# Altium project Motor Controller.PrjPcb
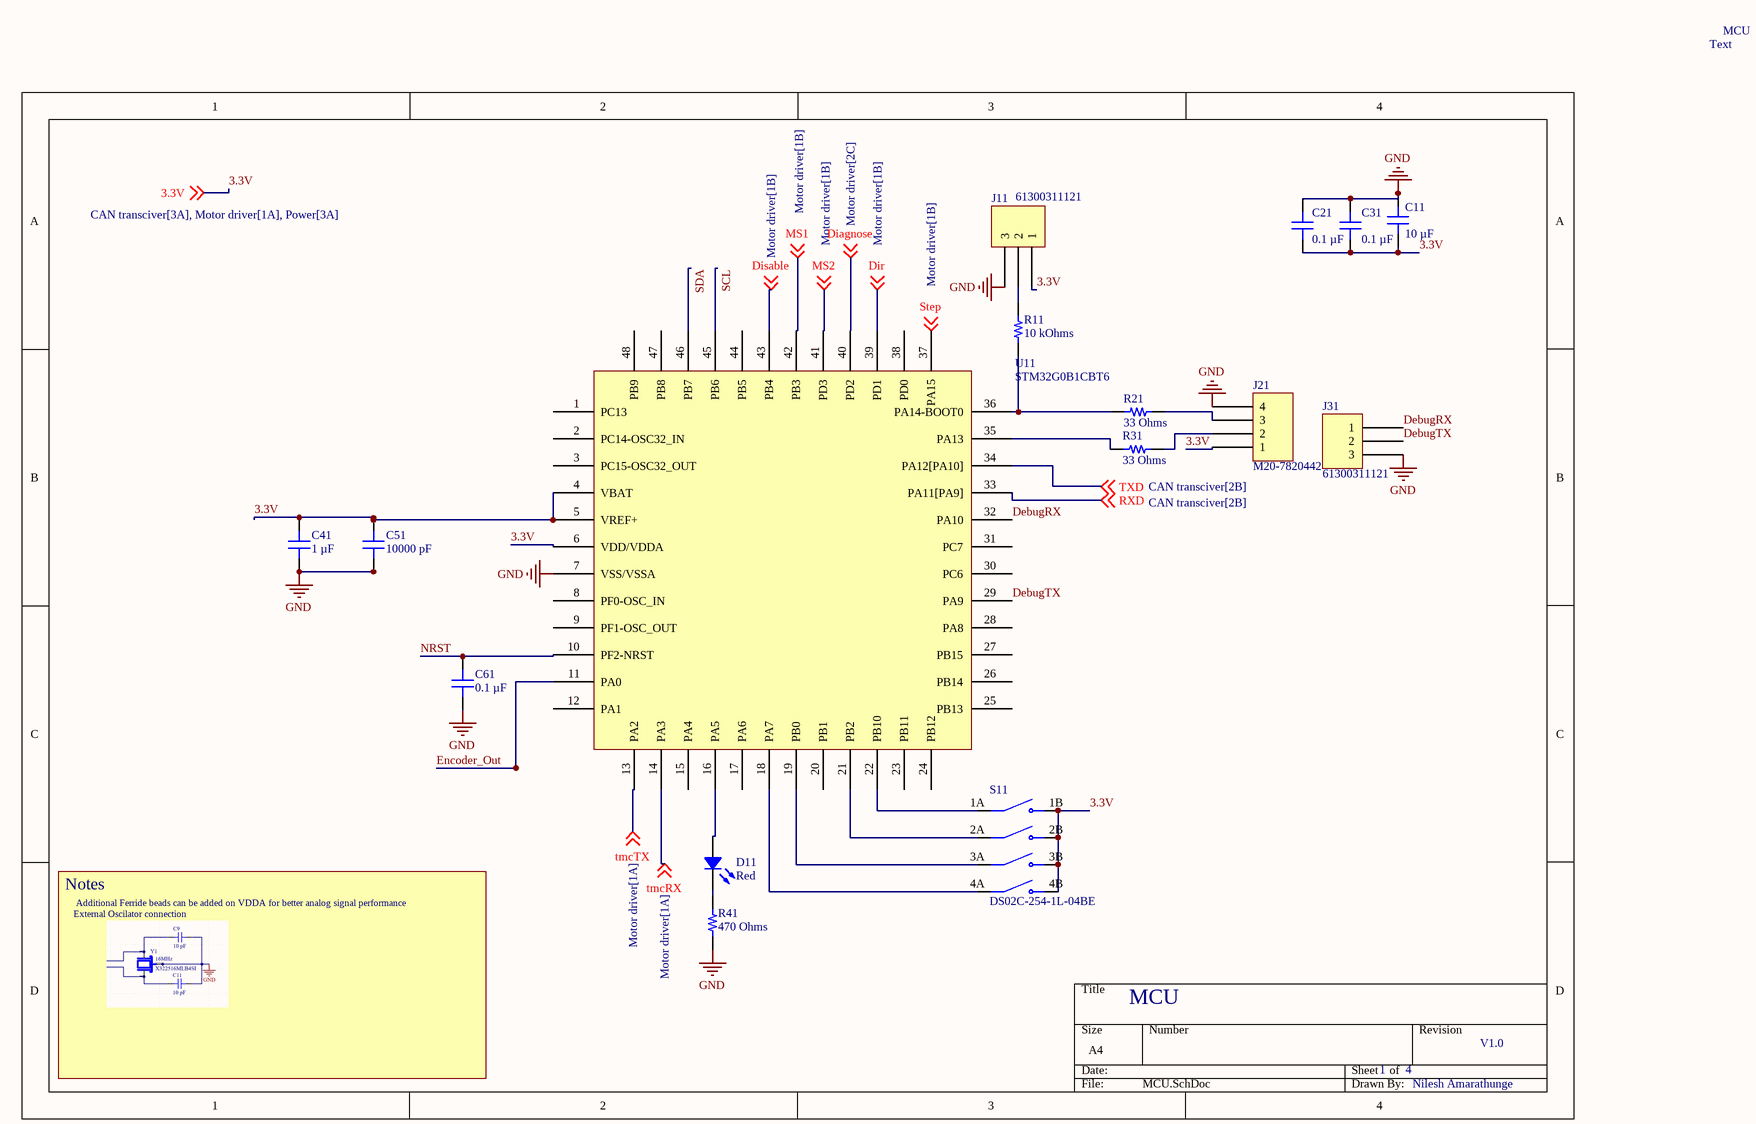
[diagram p0: MCU.SchDoc]
4 sheets, 50 parts. Net scope: global (net labels, ports and power ports of the same name join across sheets).
Board file: Motor Controller.PcbDoc
Sheets:
  MCU.SchDoc
  Power.SchDoc
  Motor driver.SchDoc
  CAN transciver.SchDoc

## Sheet MCU.SchDoc: MCU
size A4; DrawnBy: Nilesh Amarathunge; Revision: V1.0; SheetNumber: 1; SheetTotal: 4

### Parts
C11  10 µF  [CAP 0805_2012]
C21  0.1 µF  [CAP 0805_2012]
C31  0.1 µF  [CAP 0805_2012]
C41  1 µF  [CAP 0805_2012]
C51  10000 pF  [CAP 0805_2012]
C61  0.1 µF  [CAP 0805_2012]
D11  Red  [LED 0805_2012 RED]
J11  61300311121  [WURTH WE-PHD 61300311121]
J21  M20-7820442  [HARWIN M20-7820445]
J31  61300311121  [WURTH WE-PHD 61300311121]
R11  10 kOhms  [YAGEO RES 0805_2012]
R21  33 Ohms  [RES 0805_2012]
R31  33 Ohms  [RES 0805_2012]
R41  470 Ohms  [RES 0805_2012]
S11  DS02C-254-1L-04BE  [SW_DS02C-254-1L-04BE]
U11  STM32G0B1CBT6  [QFP50P900X900X160-48N]

### Nets
GND: C11.2 C21.2 C31.2 C41.2 C51.2 C61.2 J11.3 J21.4 J31.3 R41.1 U11.7(VSS/VSSA)
3.3V: C11.1 C21.1 C31.1 C41.1 C51.1 J11.1 J21.1 S11.1B(NO1) S11.2B(NO2) S11.3B(NO3) S11.4B(NO4) U11.4(VBAT) U11.5(VREF+) U11.6(VDD/VDDA) ; off-sheet 3.3V
DebugRX: J31.1 U11.32(PA10)
DebugTX: J31.2 U11.29(PA9)
Diagnose: U11.40(PD2) ; off-sheet Diagnose
Dir: U11.39(PD1) ; off-sheet Dir
Disable: U11.43(PB4) ; off-sheet Disable
Encoder_Out: U11.11(PA0)
MS1: U11.42(PB3) ; off-sheet MS1
MS2: U11.41(PD3) ; off-sheet MS2
NRST: C61.1 U11.10(PF2-NRST)
RXD: U11.33(PA11[PA9]) ; off-sheet RXD
SCL: U11.45(PB6)
SDA: U11.46(PB7)
Step: U11.37(PA15) ; off-sheet Step
tmcRx: U11.14(PA3) ; off-sheet tmcRX
tmcTX: U11.13(PA2) ; off-sheet tmcTX
TXD: U11.34(PA12[PA10]) ; off-sheet TXD
NetD11_1: D11.1 U11.16(PA5)
NetD11_2: D11.2 R41.2
NetJ11_2: J11.2 R11.1
NetJ21_2: J21.2 R31.2
NetJ21_3: J21.3 R21.2
NetR11_2: R11.2 R21.1 U11.36(PA14-BOOT0)
NetR31_1: R31.1 U11.35(PA13)
NetS11_1A: S11.1A(COM1) U11.22(PB10)
NetS11_2A: S11.2A(COM2) U11.21(PB2)
NetS11_3A: S11.3A(COM3) U11.19(PB0)
NetS11_4A: S11.4A(COM4) U11.18(PA7)

Not connected (* = marked no-connect by the designer): U11 1(PC13) 2(PC14-OSC32_IN) 3(PC15-OSC32_OUT) 8(PF0-OSC_IN) 9(PF1-OSC_OUT) 12(PA1) 15(PA4) 17(PA6) 20(PB1) 23(PB11) 24(PB12) 25(PB13) 26(PB14) 27(PB15) 28(PA8) 30(PC6) 31(PC7) 38(PD0) 44(PB5) 47(PB8) 48(PB9)

### Notes on the sheet
- Text
- Notes
- External Oscilator connection
- Additional Ferride beads can be added on VDDA for better analog signal performance

### Library data of the parts
C11 = CL21B106KPQNNNE: CAP CER 10UF 10V X7R 0805; manufacturer: Samsung Electro-Mechanics; Tolerance: ±10%; Part Number: CL21B106KPQNNNE; Capacitance: 10 µF; Applications: General Purpose; componentlink1description: Datasheet; componentlink1url: http://www.samsungsem.com/kr/support/product-search/mlcc/CL21B106KPQNNNE.jsp; componentlink2description: DigiKey Link; componentlink2url: https://www.digikey.com/en/products/detail/samsung-electro-mechanics/CL21B106KPQNNNE/3887422; Device Package: 0805 (2012 Metric); lastupdated: 2024-02-09 8:15:41 PM; Lifecycle Status: Active; Minimum Order: 1; Mounting Type: Surface Mount, MLCC; Operating Temperature: -55°C ~ 125°C; Package / Case: 0805 (2012 Metric); packaging: TapeAndReel; partid: 13130; Part Status: Active; price: 0.02; series: CL; Size / Dimension: 0.079" L x 0.049" W (2.00mm x 1.25mm); Supplier 1: DigiKey; Supplier Part Number 1: 1276-1764-1-ND; Temperature Coefficient: X7R; Thickness (Max): 0.055" (1.40mm); value: 10 µF; Voltage - Rated: 10V; LCSC part #: C32635; LCSC link: https://www.lcsc.com/product-detail/C32635.html
C21 C31 C61 = CC0805KRX7R9BB104: CAP CER 0.1UF 50V X7R 0805; manufacturer: Yageo; Tolerance: ±10%; Part Number: CC0805KRX7R9BB104; Capacitance: 0.1 µF; Applications: General Purpose; componentlink1description: Datasheet; componentlink1url: https://www.yageo.com/upload/media/product/productsearch/datasheet/mlcc/UPY-GPHC_X7R_6.3V-to-50V_18.pdf; componentlink2description: DigiKey Link; componentlink2url: https://www.digikey.com/en/products/detail/yageo/CC0805KRX7R9BB104/302874; Device Package: 0805 (2012 Metric); Features: High Voltage; lastupdated: 2024-02-09 8:15:42 PM; Lifecycle Status: Active; Minimum Order: 1; Mounting Type: Surface Mount, MLCC; Operating Temperature: -55°C ~ 125°C; Package / Case: 0805 (2012 Metric); packaging: TapeAndReel; partid: 12715; Part Status: Active; price: 0.01; series: CC; Size / Dimension: 0.079" L x 0.049" W (2.00mm x 1.25mm); Supplier 1: DigiKey; Supplier Part Number 1: 311-1140-1-ND; Temperature Coefficient: X7R; Thickness (Max): 0.033" (0.85mm); value: 0.1 µF; Voltage - Rated: 50V; LCSC part #: C49678; LCSC link: https://www.lcsc.com/product-detail/C49678.html
C41 = CL21B105KOFNNNE: CAP CER 1UF 16V X7R 0805; manufacturer: Samsung Electro-Mechanics; Tolerance: ±10%; Part Number: CL21B105KOFNNNE; Capacitance: 1 µF; Applications: General Purpose; componentlink1description: Datasheet; componentlink1url: http://www.samsungsem.com/kr/support/product-search/mlcc/CL21B105KOFNNNE.jsp; componentlink2description: DigiKey Link; componentlink2url: https://www.digikey.com/en/products/detail/samsung-electro-mechanics/CL21B105KOFNNNE/3886684; Device Package: 0805 (2012 Metric); lastupdated: 2024-02-09 8:15:36 PM; Lifecycle Status: Active; Minimum Order: 1; Mounting Type: Surface Mount, MLCC; Operating Temperature: -55°C ~ 125°C; Package / Case: 0805 (2012 Metric); packaging: TapeAndReel; partid: 14424; Part Status: Active; price: 0.01; series: CL; Size / Dimension: 0.079" L x 0.049" W (2.00mm x 1.25mm); Supplier 1: DigiKey; Supplier Part Number 1: 1276-1026-1-ND; Temperature Coefficient: X7R; Thickness (Max): 0.053" (1.35mm); value: 1 µF; Voltage - Rated: 16V; LCSC part #: C24123; LCSC link: https://www.lcsc.com/product-detail/C24123.html
C51 = CL21B103KBANNNC: CAP CER 10000PF 50V X7R 0805; manufacturer: Samsung Electro-Mechanics; Tolerance: ±10%; Part Number: CL21B103KBANNNC; Capacitance: 10000 pF; Applications: General Purpose; componentlink1description: Datasheet; componentlink1url: http://www.samsungsem.com/kr/support/product-search/mlcc/CL21B103KBANNNC.jsp; componentlink2description: DigiKey Link; componentlink2url: https://www.digikey.com/en/products/detail/samsung-electro-mechanics/CL21B103KBANNNC/3886673; Device Package: 0805 (2012 Metric); lastupdated: 2024-02-09 8:15:59 PM; Lifecycle Status: Active; Minimum Order: 1; Mounting Type: Surface Mount, MLCC; Operating Temperature: -55°C ~ 125°C; Package / Case: 0805 (2012 Metric); packaging: TapeAndReel; partid: 6199; Part Status: Active; price: 0.01; series: CL; Size / Dimension: 0.079" L x 0.049" W (2.00mm x 1.25mm); Supplier 1: DigiKey; Supplier Part Number 1: 1276-1015-1-ND; Temperature Coefficient: X7R; Thickness (Max): 0.030" (0.75mm); value: 10000 pF; Voltage - Rated: 50V; LCSC part #: C1710; LCSC link: https://www.lcsc.com/product-detail/C1710.html
D11 = 5990110007F: LED RED 0805 SMD; Manufacturer: Dialight; Configuration: Standard; Current - Test: 20mA; Lens Color: 0.80mm; Lens Size: 1.40mm x 1.25mm; Lens Style: Rectangle with Flat Top; Millicandela Rating: 29mcd; Viewing Angle: 140°; Voltage - Forward (Vf) (Typ): 2.1V; Wavelength - Dominant: 633nm; Part Number: 5990110007F; Color: Red; ComponentLink1Description: Datasheet; ComponentLink1URL: http://www.dialightsignalsandcomponents.com/Assets/Brochures_And_Catalogs/Indication/CBI_SMD_new/Dialight_CBI_data_599-0805_Apr2018.pdf; ComponentLink2Description: DigiKey Link; ComponentLink2URL: https://www.digikey.com/en/products/detail/dialight/5990110007F/9385408; Device Package: 0805 (2012 Metric); Height (Max): 0.80mm; LastUpdated: 2024-06-03 8:00:07 PM; Lifecycle Status: Active; Minimum Order: 1; Mounting Type: Surface Mount; Package / Case: 0805 (2012 Metric); Packaging: TapeAndReel; PartId: 308; Part Status: Active; Price: 0.04; Series: 599; Size / Dimension: 2.00mm L x 1.25mm W; Supplier 1: DigiKey; Supplier Part Number 1: 350-4353-1-ND; Supplier Device Package: 0805; Value: Red; LCSC part #: C84260
J11 J31 = 61300311121: CONN HEADER VERT 3POS 2.54MM; Manufacturer: Würth Elektronik; Contact Length - Mating: 0.236" (6.00mm); Contact Length - Post: 0.118" (3.00mm); Current Rating (Amps): 3A; Material Flammability Rating: UL94 V-0; Number of Positions: 3; Number of Positions Loaded: All; Overall Contact Length: 0.454" (11.54mm); Pitch - Mating: 0.100" (2.54mm); Row Spacing - Mating: -40°C ~ 105°C; Shrouding: Unshrouded; Style: Board to Board or Cable; Part Number: 61300311121; ComponentLink1Description: Datasheet; ComponentLink1URL: https://katalog.we-online.de/em/datasheet/6130xx11121.pdf; ComponentLink2Description: DigiKey Link; ComponentLink2URL: https://www.digikey.com/en/products/detail/würth-elektronik/61300311121/4846825; Connector Type: Header; Contact Finish - Mating: Gold; Contact Material: Copper Alloy; Contact Shape: Square; Contact Type: Male Pin; Fastening Type: Push-Pull; Insulation Color: Black; Insulation Height: 0.100" (2.54mm); Insulation Material: Polyamide (PA6T), Nylon 6T; LastUpdated: 2024-10-18 1:43:15 PM; Lifecycle Status: Active; Minimum Order: 1; Mounting Type: Through Hole; Number of Rows: 1; Operating Temperature: -40°C ~ 105°C; Packaging: Bulk; PartId: 189; Part Status: Active; Price: 0.07; Series: WR-PHD; Supplier 1: DigiKey; Supplier Part Number 1: 732-5316-ND; Termination: Solder
J21 = M20-7820442: CONN RCPT 4POS 0.1 GOLD PCB; Manufacturer: Harwin Inc.; Connector Type: Receptacle; Contact Length - Post: 0.118" (3.00mm); Current Rating (Amps): 3A; Mated Stacking Heights: 11.04mm, 12.63mm; Material Flammability Rating: UL94 V-0; Number of Positions: 4; Number of Positions Loaded: All; Pitch - Mating: 0.100" (2.54mm); Style: Board to Board or Cable; Part Number: M20-7820442; ComponentLink1Description: Datasheet; ComponentLink1URL: https://cdn.harwin.com/pdfs/Harwin_PC_Connectors_M20.pdf; ComponentLink2Description: DigiKey Link; ComponentLink2URL: https://www.digikey.com/en/products/detail/harwin-inc/M20-7820442/3727760; Contact Finish - Mating: Gold; Contact Finish - Post: Tin; Contact Finish Thickness - Mating: Flash; Contact Type: Female Socket; Fastening Type: Push-Pull; Insulation Color: Black; Insulation Height: 0.335" (8.51mm); LastUpdated: 2022-09-21 6:57:11 PM; Lifecycle Status: Active; Minimum Order: 1; Mounting Type: Through Hole; Number of Rows: 1; Operating Temperature: -40°C ~ 105°C; Packaging: Tube; Part Status: Active; Price: 0.45; Series: M20; Supplier 1: DigiKey; Supplier Part Number 1: 952-1791-ND; Termination: Solder
R11 = RC0805FR-0710KL: RES 10K OHM 1% 1/8W 0805; Manufacturer: Yageo; Power (Watts): 0.125W, 1/8W; Temperature Coefficient: ±100ppm/°C; Part Number: RC0805FR-0710KL; Value: 10 kOhms; ComponentLink1Description: Datasheet; ComponentLink1URL: https://www.yageo.com/upload/media/product/productsearch/datasheet/rchip/PYu-RC_Group_51_RoHS_L_10.pdf; ComponentLink2Description: DigiKey Link; ComponentLink2URL: https://www.digikey.com/en/products/detail/yageo/RC0805FR-0710KL/727535; Composition: Thick Film; Device Package: 0805 (2012 Metric); Features: Moisture Resistant; Height - Seated (Max): 0.024" (0.60mm); LastUpdated: 2024-07-25 9:20:18 AM; Lifecycle Status: Active; Minimum Order: 1; Number of Terminations: 2; Operating Temperature: -55°C ~ 155°C; Package / Case: 0805 (2012 Metric); Packaging: TapeAndReel; PartId: 46046; Part Status: Active; Price: 0.01; Resistance: 10 kOhms; Series: RC_L; Size / Dimension: 0.079" L x 0.049" W (2.00mm x 1.25mm); Supplier 1: DigiKey; Supplier Part Number 1: 311-10.0KCRCT-ND; Supplier Device Package: 0805; Tolerance: ±1%; LCSC part #: C84376; ComponentLink3Description: LCSC link; ComponentLink3URL: https://www.lcsc.com/product-detail/C84376.html?s_z=n_RC0805FR-0710KL%2520
R21 R31 = SR0805FR-4733RL: RES 33 OHM 1% 1/2W 0805; Manufacturer: Yageo; Power (Watts): 0.5W, 1/2W; Temperature Coefficient: ±100ppm/°C; Part Number: SR0805FR-4733RL; Value: 33 Ohms; ComponentLink1Description: Datasheet; ComponentLink1URL: https://www.yageo.com/upload/media/product/app/datasheet/rchip/pyu-sr_20105_rohs_l.pdf; ComponentLink2Description: DigiKey Link; ComponentLink2URL: https://www.digikey.com/en/products/detail/yageo/SR0805FR-4733RL/17026888; Composition: Thick Film; Device Package: 0805 (2012 Metric); Features: Automotive AEC-Q200, Pulse Withstanding; Height - Seated (Max): 0.024" (0.60mm); LastUpdated: 2026-04-06 8:09:11 PM; Lifecycle Status: Active; Minimum Order: 1; Number of Terminations: 2; Operating Temperature: -55°C ~ 155°C; Package / Case: 0805 (2012 Metric); Packaging: TapeAndReel; PartId: 87401; Price: 0.16; Ratings: AEC-Q200; Resistance: 33 Ohms; Series: SR; Size / Dimension: 0.079" L x 0.049" W (2.00mm x 1.25mm); Supplier 1: DigiKey; Supplier Part Number 1: 13-SR0805FR-4733RLCT-ND; Supplier Device Package: 0805; Tolerance: ±1%; LCSC part #: C6234260
R41 = ERJ-PB6B4700V: RES SMD 470 OHM 0.1% 1/4W 0805; Manufacturer: Panasonic Electronic Components; Power (Watts): 0.25W, 1/4W; Temperature Coefficient: ±50ppm/°C; Part Number: ERJ-PB6B4700V; Value: 470 Ohms; ComponentLink1Description: Datasheet; ComponentLink1URL: https://industrial.panasonic.com/cdbs/www-data/pdf/RDM0000/AOA0000C328.pdf; ComponentLink2Description: DigiKey Link; ComponentLink2URL: https://www.digikey.com/en/products/detail/panasonic-electronic-components/ERJ-PB6B4700V/6213339; Composition: Thick Film; Device Package: 0805 (2012 Metric); Features: Automotive AEC-Q200; Height - Seated (Max): 0.028" (0.70mm); LastUpdated: 2026-04-05 8:11:23 PM; Lifecycle Status: Active; Minimum Order: 1; Number of Terminations: 2; Operating Temperature: -55°C ~ 155°C; Package / Case: 0805 (2012 Metric); Packaging: TapeAndReel; PartId: 28402; Part Status: Active; Price: 0.04; Ratings: AEC-Q200; Resistance: 470 Ohms; Series: ERJ-PB6; Size / Dimension: 0.079" L x 0.049" W (2.00mm x 1.25mm); Supplier 1: DigiKey; Supplier Part Number 1: P20556CT-ND; Supplier Device Package: 0805; Tolerance: ±0.1%; LCSC part #: C441978
S11 = DS02C-254-1L-04BE: 4 Position, Through Hole, 2.54 mm Pitch, Raised Piano Slide Actuator, Convex Bottom, Long Pin, DIP Switch; MF: Same Sky; SnapEDA_Link: https://www.snapeda.com/parts/DS02C-254-1L-04BE/Same+Sky/view-part/?ref=snap; Package: None; Value: *; MP: DS02C-254-1L-04BE; Check_prices: https://www.snapeda.com/parts/DS02C-254-1L-04BE/Same+Sky/view-part/?ref=eda; LCSC part #: C5123702
U11 = STM32G0B1CBT6: LCSC part #: C2847904

## Sheet Power.SchDoc: Power
size A4; DrawnBy: Nilesh Amarathunge; Revision: V1.0; SheetNumber: 2; SheetTotal: 4
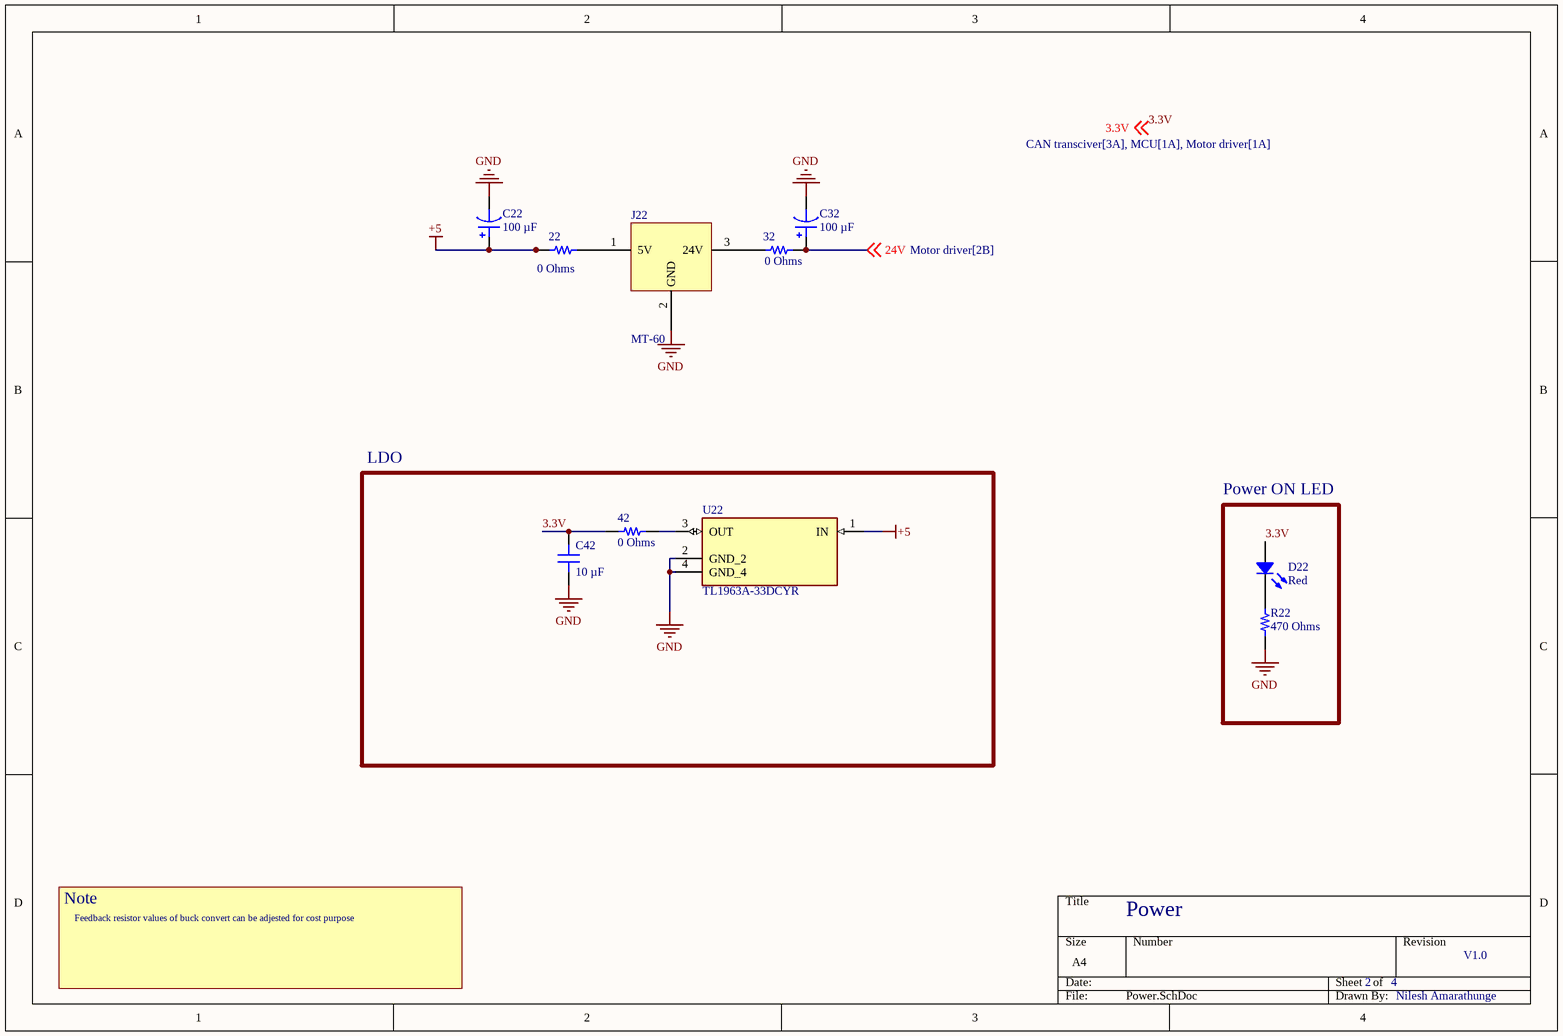
[diagram p1: Power.SchDoc]

### Parts
22  0 Ohms  [RES 0805_2012]
32  0 Ohms  [RES 0805_2012]
42  0 Ohms  [RES 0805_2012]
C22  100 µF  [CAP ALSMD 8.3MM H10.5MM]
C32  100 µF  [CAP ALSMD 8.3MM H10.5MM]
C42  10 µF  [CAP 0805_2012]
D22  Red  [LED 0805_2012 RED]
J22  MT-60  [MT-60]
R22  470 Ohms  [RES 0805_2012]
U22  TL1963A-33DCYR  [VREG_TL1963A-33DCYR]

### Blocks framed on the sheet
LDO: 42 C42 U22
Power ON LED: D22 R22

### Nets
+5: 22.1 C22.1 U22.1(IN)
GND: C22.2 C32.2 C42.1 J22.2(GND) R22.1 U22.2(GND_2) U22.4(GND_4)
3.3V: 42.1 C42.2 D22.1 ; off-sheet 3.3V
24V: 32.2 C32.1 ; off-sheet 24V
Net22_2: 22.2 J22.1(5V)
Net32_1: 32.1 J22.3(24V)
Net42_2: 42.2 U22.3(OUT)
NetD22_2: D22.2 R22.2

### Notes on the sheet
- Note
- Feedback resistor values of buck convert can be adjested for cost purpose

### Library data of the parts
22 32 42 = JR0805X35E: 0805 35 AMP JUMPER; Manufacturer: Ohmite; Power (Watts): 0.245W; Part Number: JR0805X35E; Value: 0 Ohms; ComponentLink1Description: Datasheet; ComponentLink1URL: https://www.ohmite.com/assets/docs/res_jr.pdf?r=false; ComponentLink2Description: DigiKey Link; ComponentLink2URL: https://www.digikey.com/en/products/detail/ohmite/JR0805X35E/10233372; Composition: Metal Element; Device Package: 0805 (2012 Metric); Height - Seated (Max): 0.022" (0.55mm); LastUpdated: 2026-04-05 8:11:19 PM; Lifecycle Status: Active; Minimum Order: 1; Number of Terminations: 2; Operating Temperature: -55°C ~ 150°C; Package / Case: 0805 (2012 Metric); Packaging: TapeAndReel; PartId: 29311; Part Status: Active; Price: 0.08; Resistance: 0 Ohms; Series: JR; Size / Dimension: 0.079" L x 0.049" W (2.00mm x 1.25mm); Supplier 1: DigiKey; Supplier Part Number 1: 273-JR0805X35ECT-ND; Supplier Device Package: 0805; Tolerance: Jumper
C22 C32 = 50SKV100M8X10.5: CAP ALUM 100UF 20% 50V SMD; manufacturer: Rubycon; Lifetime @ Temp.: 1000 Hrs @ 105°C; Polarization: Polar; Ripple Current @ High Frequency: 240 mA @ 10 kHz; Ripple Current @ Low Frequency: 200 mA @ 120 Hz; Surface Mount Land Size: 0.327" L x 0.327" W (8.30mm x 8.30mm); Part Number: 50SKV100M8X10.5; Applications: General Purpose; Capacitance: 100 µF; componentlink1description: Datasheet; componentlink1url: http://www.rubycon.co.jp/en/catalog/e_pdfs/aluminum/e_SKV.pdf; componentlink2description: DigiKey Link; componentlink2url: https://www.digikey.com/en/products/detail/rubycon/50SKV100M8X10-5/3568726; Device Package: Radial, Can - SMD; Height - Seated (Max): 0.413" (10.50mm); lastupdated: 2026-04-05 8:53:56 PM; Lifecycle Status: Active; Minimum Order: 1; Mounting Type: Surface Mount; Operating Temperature: -55°C ~ 105°C; Package / Case: Radial, Can - SMD; packaging: TapeAndReel; partid: 7600; Part Status: Active; price: 0.17; series: SKV; Size / Dimension: 0.315" Dia (8.00mm); Supplier 1: DigiKey; Supplier Part Number 1: 1189-3108-1-ND; Tolerance: ±20%; value: 100 µF; Voltage - Rated: 50 V; LCSC part #: C2983550
C42 = CL21B106KPQNNNE: as C11 on sheet MCU; Part Number: CL21B106KPQNNNE; Capacitance: 10 µF; Applications: General Purpose; componentlink1description: Datasheet; componentlink1url: http://www.samsungsem.com/kr/support/product-search/mlcc/CL21B106KPQNNNE.jsp; componentlink2description: DigiKey Link; componentlink2url: https://www.digikey.com/en/products/detail/samsung-electro-mechanics/CL21B106KPQNNNE/3887422; Device Package: 0805 (2012 Metric); lastupdated: 2024-02-09 8:15:41 PM; Lifecycle Status: Active; Minimum Order: 1; Mounting Type: Surface Mount, MLCC; Operating Temperature: -55°C ~ 125°C; Package / Case: 0805 (2012 Metric); packaging: TapeAndReel; partid: 13130; Part Status: Active; price: 0.02; series: CL; Size / Dimension: 0.079" L x 0.049" W (2.00mm x 1.25mm); Supplier 1: DigiKey; Supplier Part Number 1: 1276-1764-1-ND; Temperature Coefficient: X7R; Thickness (Max): 0.055" (1.40mm); value: 10 µF; Voltage - Rated: 10V; LCSC part #: C32635; LCSC link: https://www.lcsc.com/product-detail/C32635.html
D22 = 5990110007F: as D11 on sheet MCU; Part Number: 5990110007F; Color: Red; ComponentLink1Description: Datasheet; ComponentLink1URL: http://www.dialightsignalsandcomponents.com/Assets/Brochures_And_Catalogs/Indication/CBI_SMD_new/Dialight_CBI_data_599-0805_Apr2018.pdf; ComponentLink2Description: DigiKey Link; ComponentLink2URL: https://www.digikey.com/en/products/detail/dialight/5990110007F/9385408; Device Package: 0805 (2012 Metric); Height (Max): 0.80mm; LastUpdated: 2024-06-03 8:00:07 PM; Lifecycle Status: Active; Minimum Order: 1; Mounting Type: Surface Mount; Package / Case: 0805 (2012 Metric); Packaging: TapeAndReel; PartId: 308; Part Status: Active; Price: 0.04; Series: 599; Size / Dimension: 2.00mm L x 1.25mm W; Supplier 1: DigiKey; Supplier Part Number 1: 350-4353-1-ND; Supplier Device Package: 0805; Value: Red; LCSC part #: C19171391
R22 = ERJ-PB6B4700V: as R41 on sheet MCU; Part Number: ERJ-PB6B4700V; Value: 470 Ohms; ComponentLink1Description: Datasheet; ComponentLink1URL: https://industrial.panasonic.com/cdbs/www-data/pdf/RDM0000/AOA0000C328.pdf; ComponentLink2Description: DigiKey Link; ComponentLink2URL: https://www.digikey.com/en/products/detail/panasonic-electronic-components/ERJ-PB6B4700V/6213339; Composition: Thick Film; Device Package: 0805 (2012 Metric); Features: Automotive AEC-Q200; Height - Seated (Max): 0.028" (0.70mm); LastUpdated: 2026-04-05 8:11:23 PM; Lifecycle Status: Active; Minimum Order: 1; Number of Terminations: 2; Operating Temperature: -55°C ~ 155°C; Package / Case: 0805 (2012 Metric); Packaging: TapeAndReel; PartId: 28402; Part Status: Active; Price: 0.04; Ratings: AEC-Q200; Resistance: 470 Ohms; Series: ERJ-PB6; Size / Dimension: 0.079" L x 0.049" W (2.00mm x 1.25mm); Supplier 1: DigiKey; Supplier Part Number 1: P20556CT-ND; Supplier Device Package: 0805; Tolerance: ±0.1%; LCSC part #: C441978
U22 = TL1963A-33DCYR: 1.5-A, 20-V, low-dropout voltage regulator with reverse current & reverse voltage protection; MF: Texas Instruments; SnapEDA_Link: https://www.snapeda.com/parts/TL1963A-33DCYR/Texas+Instruments/view-part/?ref=snap; Package: SOT-223-4 Texas Instruments; Value: *; MP: TL1963A-33DCYR; Check_prices: https://www.snapeda.com/parts/TL1963A-33DCYR/Texas+Instruments/view-part/?ref=eda; LCSC part #: C181262
J22 = MT-60: LCSC part #: C99176

## Sheet Motor driver.SchDoc: Stepper Driver
size A4; DrawnBy: Nilesh Amarathunge; Revision: V1.0; SheetNumber: 3; SheetTotal: 4
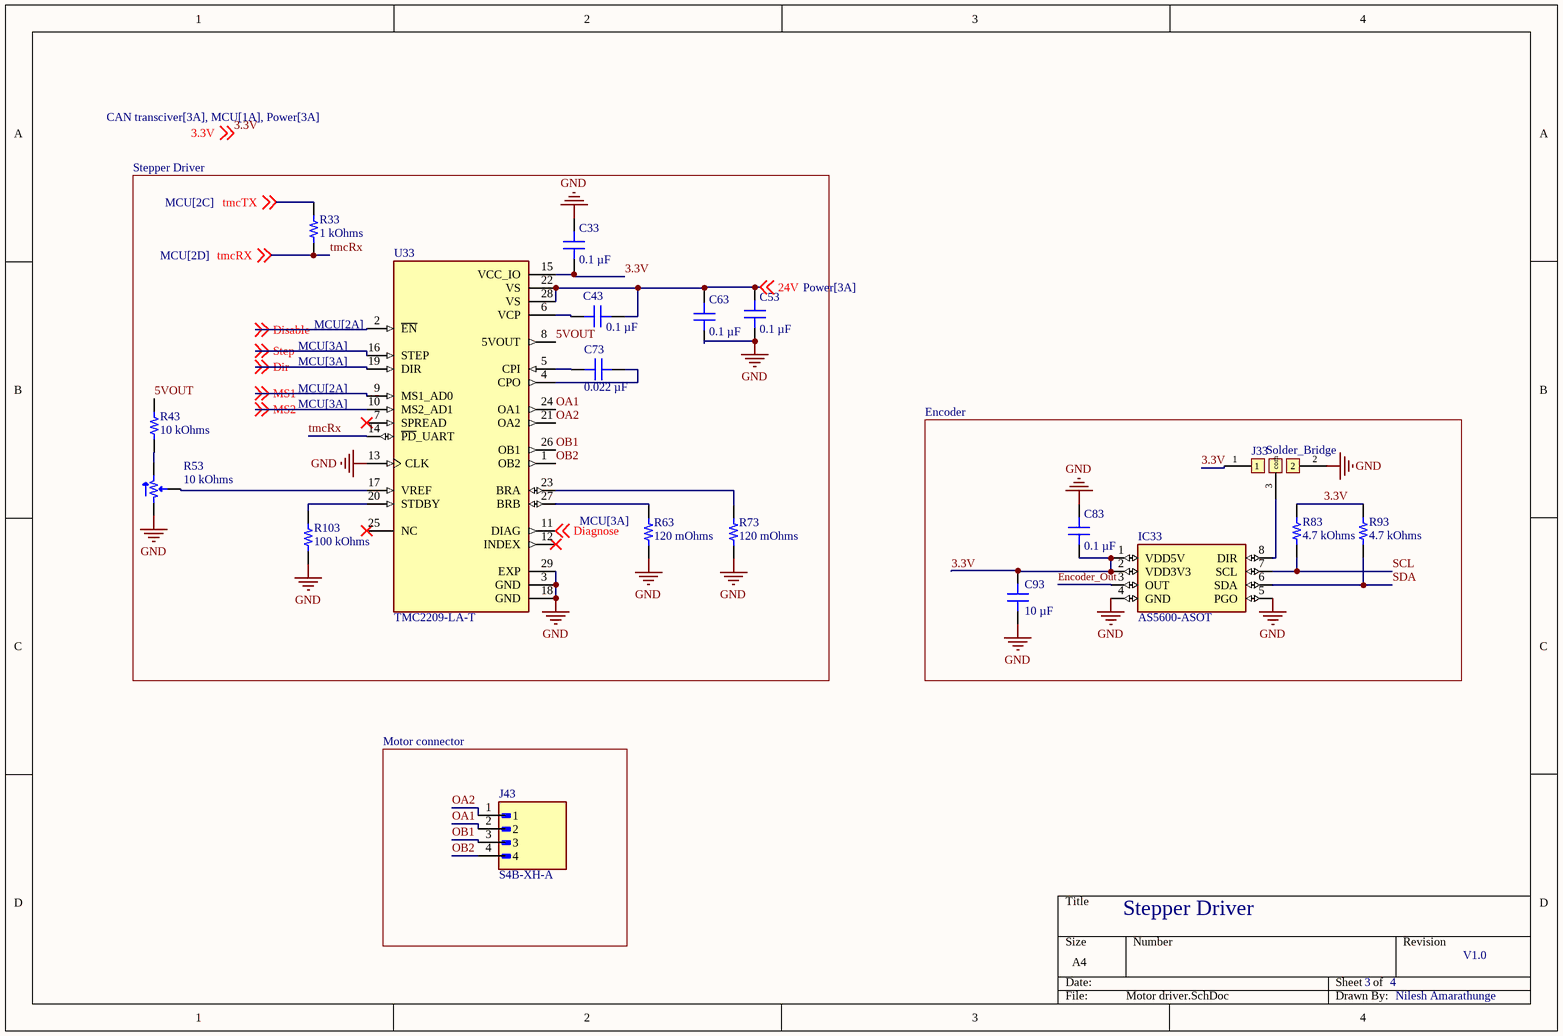
[diagram p2: Motor driver.SchDoc]

### Parts
C33  0.1 µF  [CAP 0805_2012]
C43  0.1 µF  [CAP 0805_2012]
C53  0.1 µF  [CAP 0805_2012]
C63  0.1 µF  [CAP 0805_2012]
C73  0.022 µF  [MURATA GRM21B 0805_2012]
C83  0.1 µF  [CAP 0805_2012]
C93  10 µF  [CAP 0805_2012]
IC33  AS5600-ASOT  [SOIC127P600X175-8N]
J33  Solder_Bridge  [Solder_Bridge]
J43  S4B-XH-A  [JST_S4B-XH-A]
R33  1 kOhms  [YAGEO RES 0805_2012]
R43  10 kOhms  [YAGEO RES 0805_2012]
R53  10 kOhms  [POT BOURNS TRIMPOT TC33]
R63  120 mOhms  [YAGEO RES 1206_3216]
R73  120 mOhms  [YAGEO RES 1206_3216]
R83  4.7 kOhms  [YAGEO RES 0805_2012]
R93  4.7 kOhms  [YAGEO RES 0805_2012]
R103  100 kOhms  [YAGEO RES 0805_2012]
U33  TMC2209-LA-T  [QFN50P500X500X90-29N]

### Blocks framed on the sheet
Stepper Driver: C33 C43 C53 C63 C73 R33 R43 R53 R63 R73 R103 U33
Encoder: C83 C93 IC33 J33 R83 R93
Motor connector: J43

### Nets
GND: C33.2 C53.1 C63.1 C83.2 C93.1 IC33.4(GND) IC33.5(PGO) J33.2 R53.1 R63.1 R73.1 R103.1 U33.3(GND) U33.13(CLK) U33.18(GND) U33.29(EXP)
3.3V: C33.1 C83.1 C93.2 IC33.1(VDD5V) IC33.2(VDD3V3) J33.1 R83.1 R93.1 U33.15(VCC_IO) ; off-sheet 3.3V
5VOUT: R43.2 U33.8(5VOUT)
24V: C43.1 C53.2 C63.2 U33.22(VS) U33.28(VS) ; off-sheet 24V
Diagnose: U33.11(DIAG) ; off-sheet Diagnose
Dir: U33.19(DIR) ; off-sheet Dir
Disable: U33.2(~{EN}) ; off-sheet Disable
Encoder_Out: IC33.3(OUT)
MS1: U33.9(MS1_AD0) ; off-sheet MS1
MS2: U33.10(MS2_AD1) ; off-sheet MS2
OA1: J43.2 U33.24(OA1)
OA2: J43.1 U33.21(OA2)
OB1: J43.3 U33.26(OB1)
OB2: J43.4 U33.1(OB2)
SCL: IC33.7(SCL) R83.2
SDA: IC33.6(SDA) R93.2
Step: U33.16(STEP) ; off-sheet Step
tmcRx: R33.1 U33.14(~{PD}_UART) ; off-sheet tmcRX
tmcTX: R33.2 ; off-sheet tmcTX
NetC43_2: C43.2 U33.6(VCP)
NetC73_1: C73.1 U33.5(CPI)
NetC73_2: C73.2 U33.4(CPO)
NetIC33_8: IC33.8(DIR) J33.3(com)
NetR43_1: R43.1 R53.3
NetR53_2: R53.2 U33.17(VREF)
NetR63_2: R63.2 U33.27(BRB)
NetR73_2: R73.2 U33.23(BRA)
NetR103_2: R103.2 U33.20(STDBY)

Not connected (* = marked no-connect by the designer): U33 7(SPREAD)* 12(INDEX)* 25(NC)*

### Library data of the parts
C33 C43 C53 C63 C83 = CC0805KRX7R9BB104: as C21 on sheet MCU; Part Number: CC0805KRX7R9BB104; Capacitance: 0.1 µF; Applications: General Purpose; componentlink1description: Datasheet; componentlink1url: https://www.yageo.com/upload/media/product/productsearch/datasheet/mlcc/UPY-GPHC_X7R_6.3V-to-50V_18.pdf; componentlink2description: DigiKey Link; componentlink2url: https://www.digikey.com/en/products/detail/yageo/CC0805KRX7R9BB104/302874; Device Package: 0805 (2012 Metric); Features: High Voltage; lastupdated: 2024-02-09 8:15:42 PM; Lifecycle Status: Active; Minimum Order: 1; Mounting Type: Surface Mount, MLCC; Operating Temperature: -55°C ~ 125°C; Package / Case: 0805 (2012 Metric); packaging: TapeAndReel; partid: 12715; Part Status: Active; price: 0.01; series: CC; Size / Dimension: 0.079" L x 0.049" W (2.00mm x 1.25mm); Supplier 1: DigiKey; Supplier Part Number 1: 311-1140-1-ND; Temperature Coefficient: X7R; Thickness (Max): 0.033" (0.85mm); value: 0.1 µF; Voltage - Rated: 50V; LCSC part #: C49678; LCSC link: https://www.lcsc.com/product-detail/C49678.html
C73 = GRM21B5C1H223JA01L: CAP CER 0.022UF 50V C0G/NP0 0805; manufacturer: Murata Electronics; Temperature Coefficient: C0G, NP0; Tolerance: ±5%; Part Number: GRM21B5C1H223JA01L; Capacitance: 0.022 µF; Applications: General Purpose; componentlink1description: Datasheet; componentlink1url: https://search.murata.co.jp/Ceramy/image/img/A01X/G101/ENG/GRM21B5C1H223JA01-01.pdf; componentlink2description: DigiKey Link; componentlink2url: https://www.digikey.com/en/products/detail/murata-electronics/GRM21B5C1H223JA01L/586677; Device Package: 0805 (2012 Metric); lastupdated: 2024-08-27 9:29:56 AM; Lifecycle Status: Active; Minimum Order: 1; Mounting Type: Surface Mount, MLCC; Operating Temperature: -55°C ~ 125°C; Package / Case: 0805 (2012 Metric); packaging: TapeAndReel; partid: 7435; Part Status: Active; price: 0.06; series: GRM; Size / Dimension: 0.079" L x 0.049" W (2.00mm x 1.25mm); Supplier 1: DigiKey; Supplier Part Number 1: 490-1644-1-ND; Thickness (Max): 0.053" (1.35mm); value: 0.022 µF; Voltage - Rated: 50V; LCSC part #: C77069
C93 = CL21B106KPQNNNE: as C11 on sheet MCU; Part Number: CL21B106KPQNNNE; Capacitance: 10 µF; Applications: General Purpose; componentlink1description: Datasheet; componentlink1url: http://www.samsungsem.com/kr/support/product-search/mlcc/CL21B106KPQNNNE.jsp; componentlink2description: DigiKey Link; componentlink2url: https://www.digikey.com/en/products/detail/samsung-electro-mechanics/CL21B106KPQNNNE/3887422; Device Package: 0805 (2012 Metric); lastupdated: 2024-02-09 8:15:41 PM; Lifecycle Status: Active; Minimum Order: 1; Mounting Type: Surface Mount, MLCC; Operating Temperature: -55°C ~ 125°C; Package / Case: 0805 (2012 Metric); packaging: TapeAndReel; partid: 13130; Part Status: Active; price: 0.02; series: CL; Size / Dimension: 0.079" L x 0.049" W (2.00mm x 1.25mm); Supplier 1: DigiKey; Supplier Part Number 1: 1276-1764-1-ND; Temperature Coefficient: X7R; Thickness (Max): 0.055" (1.40mm); value: 10 µF; Voltage - Rated: 10V; LCSC part #: C32635; LCSC link: https://www.lcsc.com/product-detail/C32635.html
IC33 = AS5600-ASOT: Hall Effect Sensor Angle External Magnet, Not Included Gull Wing; MF: ams; SnapEDA_Link: https://www.snapeda.com/parts/AS5600-ASOT/ams/view-part/?ref=snap; Package: SOIC-8 ams; Value: *; MP: AS5600-ASOT; Check_prices: https://www.snapeda.com/parts/AS5600-ASOT/ams/view-part/?ref=eda; LCSC part #: C499458
R33 = SR0805JR-7W1KL: RES 1K OHM 5% 1/4W 0805; Manufacturer: Yageo; Power (Watts): 0.25W, 1/4W; Temperature Coefficient: ±100ppm/°C; Part Number: SR0805JR-7W1KL; Value: 1 kOhms; ComponentLink1Description: Datasheet; ComponentLink1URL: http://www.yageo.com/documents/recent/PYu-SR_20105_RoHS_L_8.pdf; ComponentLink2Description: DigiKey Link; ComponentLink2URL: https://www.digikey.com/en/products/detail/yageo/SR0805JR-7W1KL/9696409; Composition: Thick Film; Device Package: 0805 (2012 Metric); Features: Automotive AEC-Q200, Pulse Withstanding; Height - Seated (Max): 0.024" (0.60mm); LastUpdated: 2026-04-05 9:18:17 PM; Lifecycle Status: Active; Minimum Order: 1; Number of Terminations: 2; Operating Temperature: -55°C ~ 155°C; Package / Case: 0805 (2012 Metric); Packaging: TapeAndReel; PartId: 30716; Part Status: Active; Price: 0.02; Ratings: AEC-Q200; Resistance: 1 kOhms; Series: SR; Size / Dimension: 0.079" L x 0.049" W (2.00mm x 1.25mm); Supplier 1: DigiKey; Supplier Part Number 1: YAG6171CT-ND; Supplier Device Package: 0805; Tolerance: ±5%; LCSC part #: C441981
R43 = RC0805FR-0710KL: as R11 on sheet MCU; Part Number: RC0805FR-0710KL; Value: 10 kOhms; ComponentLink1Description: Datasheet; ComponentLink1URL: https://www.yageo.com/upload/media/product/productsearch/datasheet/rchip/PYu-RC_Group_51_RoHS_L_10.pdf; ComponentLink2Description: DigiKey Link; ComponentLink2URL: https://www.digikey.com/en/products/detail/yageo/RC0805FR-0710KL/727535; Composition: Thick Film; Device Package: 0805 (2012 Metric); Features: Moisture Resistant; Height - Seated (Max): 0.024" (0.60mm); LastUpdated: 2024-07-25 9:20:18 AM; Lifecycle Status: Active; Minimum Order: 1; Number of Terminations: 2; Operating Temperature: -55°C ~ 155°C; Package / Case: 0805 (2012 Metric); Packaging: TapeAndReel; PartId: 46046; Part Status: Active; Price: 0.01; Resistance: 10 kOhms; Series: RC_L; Size / Dimension: 0.079" L x 0.049" W (2.00mm x 1.25mm); Supplier 1: DigiKey; Supplier Part Number 1: 311-10.0KCRCT-ND; Supplier Device Package: 0805; Tolerance: ±1%; LCSC part #: C84376; ComponentLink3Description: LCSC link; ComponentLink3URL: https://www.lcsc.com/product-detail/C84376.html?s_z=n_RC0805FR-0710KL%2520
R53 = TC33X-2-103E: TRIMMER 10K OHM 0.15W J LEAD TOP; Manufacturer: Bourns Inc.; Adjustment Type: Top Adjustment; Number of Turns: 1; Resistive Material: Cermet; Temperature Coefficient: ±250ppm/°C; Tolerance: ±25%; Part Number: TC33X-2-103E; ComponentLink1Description: Datasheet; ComponentLink1URL: https://www.bourns.com/docs/Product-Datasheets/TC33.pdf; ComponentLink2Description: DigiKey Link; ComponentLink2URL: https://www.digikey.com/en/products/detail/bourns-inc/TC33X-2-103E/612858; LastUpdated: 2024-06-03 8:01:52 PM; Lifecycle Status: Active; Minimum Order: 1; Mounting Type: Surface Mount; Packaging: TapeAndReel; PartId: 8; Part Status: Active; Power (Watts): 0.15W; Price: 0.11; Resistance: 10 kOhms; Series: Trimpot® TC33 - Open Frame; Size / Dimension: Rectangular - 0.150" x 0.142" Face (3.80mm x 3.60mm); Supplier 1: DigiKey; Supplier Part Number 1: TC33X-103ECT-ND; Termination Style: J Lead; Value: 10 kOhms; LCSC part #: C719176
R63 R73 = PE1206FRF470R12L: RES 0.12 OHM 1% 1W 1206; Manufacturer: Yageo; Temperature Coefficient: ±100ppm/°C; Part Number: PE1206FRF470R12L; ComponentLink1Description: Datasheet; ComponentLink1URL: https://www.yageo.com/upload/media/product/productsearch/datasheet/rchip/PYu-PE_521_RoHS_L_10.pdf; ComponentLink2Description: DigiKey Link; ComponentLink2URL: https://www.digikey.com/en/products/detail/yageo/PE1206FRF470R12L/16642038; Composition: Metal Film; Device Package: 1206 (3216 Metric); Features: Automotive AEC-Q200, Current Sense; Height - Seated (Max): 0.035" (0.89mm); LastUpdated: 2024-07-25 9:21:19 AM; Lifecycle Status: Active; Minimum Order: 1; Number of Terminations: 2; Operating Temperature: -55°C ~ 170°C; Package / Case: 1206 (3216 Metric); Packaging: TapeAndReel; PartId: 72617; Part Status: Active; Power (Watts): 1W; Price: 0.09; Ratings: AEC-Q200; Resistance: 120 mOhms; Series: PE_L; Size / Dimension: 0.126" L x 0.063" W (3.20mm x 1.60mm); Supplier 1: DigiKey; Supplier Part Number 1: 13-PE1206FRF470R12LCT-ND; Supplier Device Package: 1206; Tolerance: ±1%; Value: 120 mOhms; LCSC part #: C6356569
R83 R93 = RT0805BRD074K7L: RES SMD 4.7K OHM 0.1% 1/8W 0805; Manufacturer: Yageo; Power (Watts): 0.125W, 1/8W; Temperature Coefficient: ±25ppm/°C; Part Number: RT0805BRD074K7L; Value: 4.7 kOhms; ComponentLink1Description: Datasheet; ComponentLink1URL: https://www.yageo.com/upload/media/product/productsearch/datasheet/rchip/PYu-RT_1-to-0.01_RoHS_L_11.pdf; ComponentLink2Description: DigiKey Link; ComponentLink2URL: https://www.digikey.com/en/products/detail/yageo/RT0805BRD074K7L/1075937; Composition: Thin Film; Device Package: 0805 (2012 Metric); Height - Seated (Max): 0.024" (0.60mm); LastUpdated: 2024-07-25 9:20:24 AM; Lifecycle Status: Active; Minimum Order: 1; Number of Terminations: 2; Operating Temperature: -55°C ~ 155°C; Package / Case: 0805 (2012 Metric); Packaging: TapeAndReel; PartId: 36704; Part Status: Active; Price: 0.04; Resistance: 4.7 kOhms; Series: RT; Size / Dimension: 0.079" L x 0.049" W (2.00mm x 1.25mm); Supplier 1: DigiKey; Supplier Part Number 1: YAG1919CT-ND; Supplier Device Package: 0805; Tolerance: ±0.1%; LCSC part #: C865532
R103 = RT0805BRD07160KL: RES SMD 100K OHM 0.1% 1/8W 0805; Manufacturer: Yageo; Power (Watts): 0.125W, 1/8W; Resistance: 160 kOhms; Temperature Coefficient: ±25ppm/°C; Part Number: RT0805BRD07160KL; Value: 100 kOhms; ComponentLink1Description: Datasheet; ComponentLink1URL: https://www.yageo.com/upload/media/product/productsearch/datasheet/rchip/PYu-RT_1-to-0.01_RoHS_L_11.pdf; ComponentLink2Description: DigiKey Link; ComponentLink2URL: https://www.digikey.com/en/products/detail/yageo/RT0805BRD07160KL/1075623; Composition: Thin Film; Device Package: 0805 (2012 Metric); Height - Seated (Max): 0.024" (0.60mm); LastUpdated: 2024-07-25 9:20:21 AM; Lifecycle Status: Active; Minimum Order: 1; Number of Terminations: 2; Operating Temperature: -55°C ~ 155°C; Package / Case: 0805 (2012 Metric); Packaging: TapeAndReel; PartId: 40673; Part Status: Active; Price: 0.04; Series: RT; Size / Dimension: 0.079" L x 0.049" W (2.00mm x 1.25mm); Supplier 1: DigiKey; Supplier Part Number 1: YAG1788CT-ND; Supplier Device Package: 0805; Tolerance: ±0.1%; LCSC part #: C122537; ComponentLink3Description: LCSC link; ComponentLink3URL: https://www.lcsc.com/product-detail/C865212.html?s_z=n_RT0805BRD07160KL
U33 = TMC2209-LA-T: Bipolar Motor Driver Power MOSFET Step/Direction, UART 28-QFN (5x5); MF: Trinamic Motion Control GmbH; SnapEDA_Link: https://www.snapeda.com/parts/TMC2209-LA-T/Trinamic/view-part/?ref=snap; Package: VFQFN-28 Trinamic; Value: *; MP: TMC2209-LA-T; Check_prices: https://www.snapeda.com/parts/TMC2209-LA-T/Trinamic/view-part/?ref=eda; LCSC part #: C2150710
J43 = S4B-XH-A: Package: None; Price: None; Value: *; MP: S4B-XH-A; Availability: Unavailable; LCSC part #: C19271397

## Sheet CAN transciver.SchDoc: CAN transciever
size A; DrawnBy: Nilesh Amarathunge; Revision: V1.0; SheetNumber: 4; SheetTotal: 4
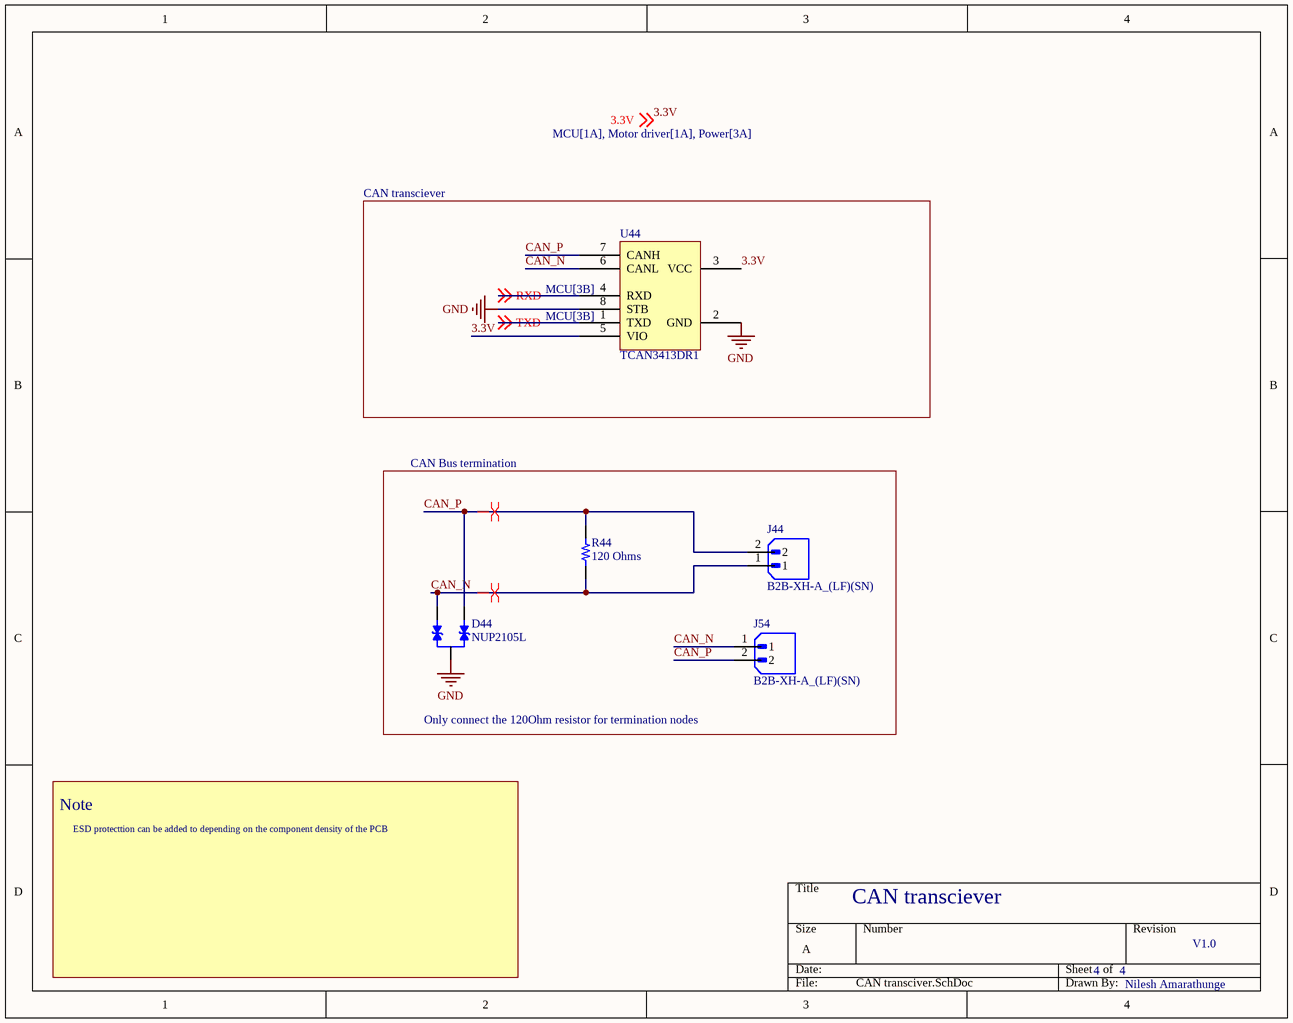
[diagram p3: CAN transciver.SchDoc]

### Parts
D44  NUP2105L  [SOT95P240X120-3N]
J44  B2B-XH-A_(LF)(SN)  [JST_B2B-XH-A_(LF)(SN)]
J54  B2B-XH-A_(LF)(SN)  [JST_B2B-XH-A_(LF)(SN)]
R44  120 Ohms  [RES 0805_2012]
U44  TCAN3413DR1  [TCAN3413DR1]

### Blocks framed on the sheet
CAN transciever: U44

### Nets
GND: D44.3 U44.2(GND) U44.8(STB)
3.3V: U44.3(VCC) U44.5(VIO) ; off-sheet 3.3V
CAN_N: D44.2 J44.1 J54.1 R44.1 U44.6(CANL)
CAN_P: D44.1 J44.2 J54.2 R44.2 U44.7(CANH)
RXD: U44.4(RXD) ; off-sheet RXD
TXD: U44.1(TXD) ; off-sheet TXD

### Layout directives
differential pair: CAN_N, CAN_P

### Notes on the sheet
- CAN Bus termination
- Only connect the 120Ohm resistor for termination nodes
- Note
- ESD protecttion can be added to depending on the component density of the PCB

### Library data of the parts
D44 = NUP2105L: ESD, SOT-23, 0.1ÂµA, 24V, Unidir; MF: Diotec Semiconductor; SnapEDA_Link: https://www.snapeda.com/parts/NUP2105L/Diotec/view-part/?ref=snap; Package: SOT-23 Diotec; Value: *; MP: NUP2105L; Check_prices: https://www.snapeda.com/parts/NUP2105L/Diotec/view-part/?ref=eda; LCSC part #: C14486
J44 J54 = B2B-XH-A_(LF)(SN): Connector Header Through Hole 2 position 0.098 (2.50mm); MF: JST Sales; MP: B2B-XH-A (LF)(SN); SnapEDA_Link: https://www.snapeda.com/parts/B2B-XH-A%20(LF)(SN)/JST+Sales+America+Inc./view-part/?ref=snap; Package: None; Value: *; Check_prices: https://www.snapeda.com/parts/B2B-XH-A%20(LF)(SN)/JST+Sales+America+Inc./view-part/?ref=eda; LCSC part #: C19271386
R44 = ERJ-6GEYJ121V: RES SMD 120 OHM 5% 1/8W 0805; Manufacturer: Panasonic Electronic Components; Power (Watts): 0.125W, 1/8W; Temperature Coefficient: ±200ppm/°C; Part Number: ERJ-6GEYJ121V; Value: 120 Ohms; ComponentLink1Description: Datasheet; ComponentLink1URL: http://industrial.panasonic.com/www-cgi/jvcr13pz.cgi?E+PZ+3+AOA0001+ERJ6GEYJ121V+7+WW; ComponentLink2Description: DigiKey Link; ComponentLink2URL: https://www.digikey.com/en/products/detail/panasonic-electronic-components/ERJ-6GEYJ121V/89685; Composition: Thick Film; Device Package: 0805 (2012 Metric); Features: Automotive AEC-Q200; Height - Seated (Max): 0.028" (0.70mm); LastUpdated: 2024-02-08 9:02:29 PM; Lifecycle Status: Active; Minimum Order: 1; Number of Terminations: 2; Operating Temperature: -55°C ~ 155°C; Package / Case: 0805 (2012 Metric); Packaging: TapeAndReel; PartId: 30081; Part Status: Active; Price: 0.01; Ratings: AEC-Q200; Resistance: 120 Ohms; Series: ERJ-6G; Size / Dimension: 0.079" L x 0.049" W (2.00mm x 1.25mm); Supplier 1: DigiKey; Supplier Part Number 1: P120ACT-ND; Supplier Device Package: 0805; Tolerance: ±5%; LCSC part #: C410053
U44 = TCAN3413DR1: LCSC part #: C22396693

## Nets that join several sheets
GND: MCU (11 pins), Power (7 pins), Motor driver (16 pins), CAN transciver (D44.3 U44.2 U44.8)
3.3V: MCU (14 pins), Power (42.1 C42.2 D22.1), Motor driver (9 pins), CAN transciver (U44.3 U44.5)
24V: Power (32.2 C32.1), Motor driver (5 pins)
Diagnose: MCU (U11.40), Motor driver (U33.11)
Dir: MCU (U11.39), Motor driver (U33.19)
Disable: MCU (U11.43), Motor driver (U33.2)
Encoder_Out: MCU (U11.11), Motor driver (IC33.3)
MS1: MCU (U11.42), Motor driver (U33.9)
MS2: MCU (U11.41), Motor driver (U33.10)
RXD: MCU (U11.33), CAN transciver (U44.4)
SCL: MCU (U11.45), Motor driver (IC33.7 R83.2)
SDA: MCU (U11.46), Motor driver (IC33.6 R93.2)
Step: MCU (U11.37), Motor driver (U33.16)
tmcRx: MCU (U11.14), Motor driver (R33.1 U33.14)
tmcTX: MCU (U11.13), Motor driver (R33.2)
TXD: MCU (U11.34), CAN transciver (U44.1)